# EAGLE design jcbp-290 (EAGLE 8.0.0)
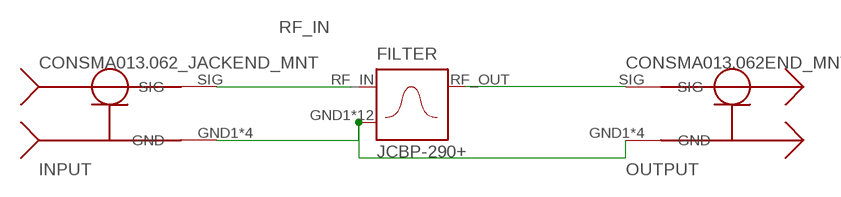
[diagram p0: schematic, sheet 1]

## Parts
FILTER  JCBP-290+  [BG291]
INPUT  CONSMA013.062_JACKEND_MNT  [SMA_EDGE_MNT]
OUTPUT  CONSMA013.062END_MNT  [SMA_EDGE_MNT]

## Nets
GND: FILTER.GND1(GND) FILTER.GND3(GND) FILTER.GND4(GND) FILTER.GND5(GND) FILTER.GND6(GND) FILTER.GND7(GND) FILTER.GND8(GND) FILTER.GND10(GND) FILTER.GND11(GND) FILTER.GND12(GND) FILTER.GND13(GND) FILTER.GND14(GND) INPUT.GND1(GND) INPUT.GND2(GND) INPUT.GND3(GND) INPUT.GND4(GND) OUTPUT.GND1(GND) OUTPUT.GND2(GND) OUTPUT.GND3(GND) OUTPUT.GND4(GND)
N$2: FILTER.RF_OUT OUTPUT.SIG
RF_IN: FILTER.RF_IN INPUT.SIG

## Library data of the parts
FILTER = balun:JCBP-290+
INPUT = balun:CONSMA013.062_JACK
OUTPUT = balun:CONSMA013.062

## Net classes
0 default: clearance 0.205 mm

## Board
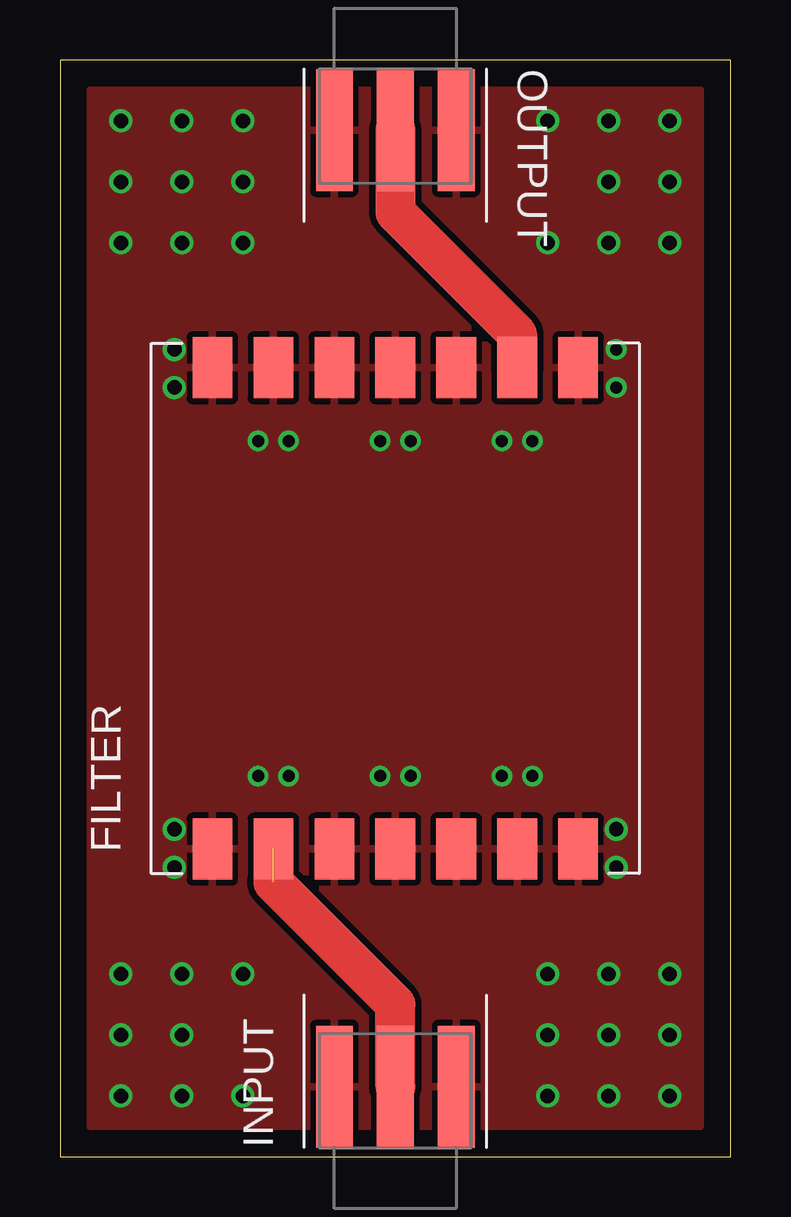
[diagram p1: board, top side]
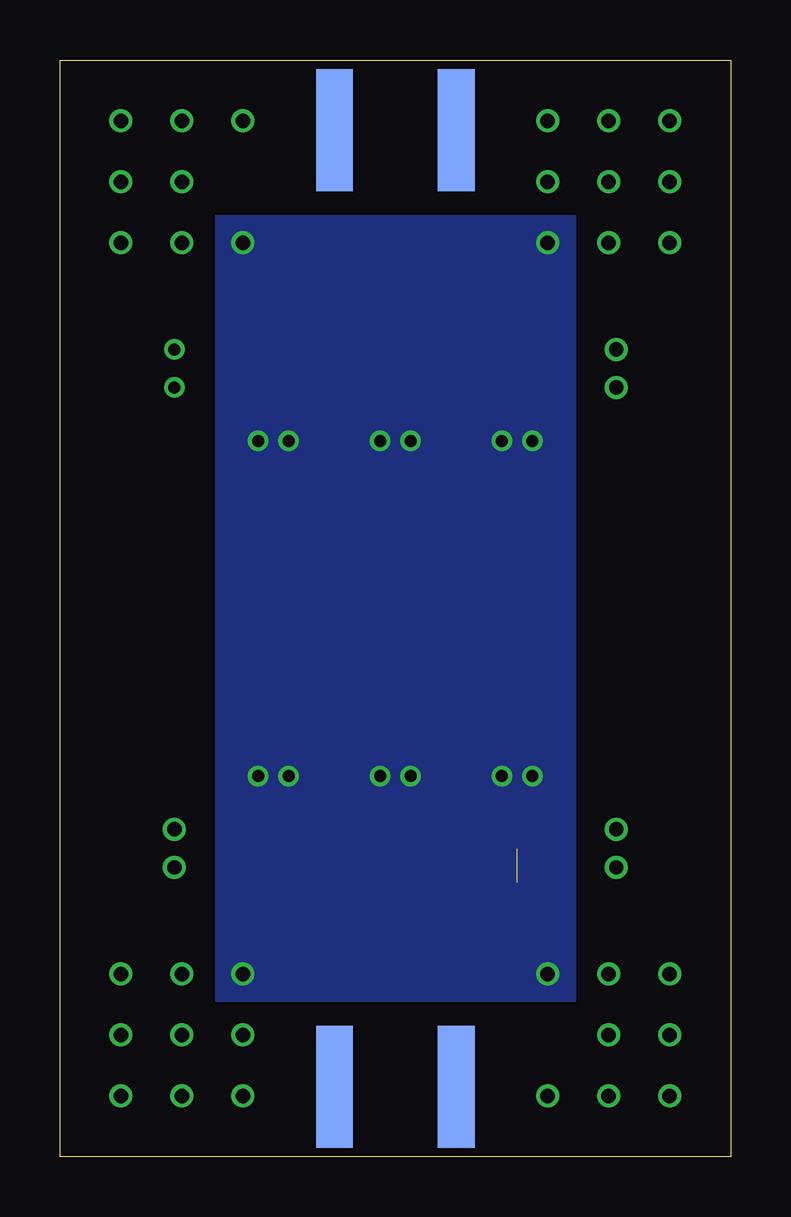
[diagram p2: board, bottom side, seen from below]

Size 27.94 x 45.72 mm. Coordinates in mm from the lower left corner, seen from the top.
Outline: 0,0 27.94,0 27.94,45.72 0,45.72 0,0
Copper layers (1*16): Top 0.0356mm / dielectric 1.5011mm / Bottom 0.0356mm
Design rules "LaenPCBOrder": minimum track width 6mil, minimum drill 13mil, track to track 6mil, track to pad 6mil, pad to pad 6mil, via to via 6mil, smd to smd 6mil, copper to edge 15mil, drill to drill 6mil, minimum pad ring 7mil, minimum via ring 7mil, stop-mask expansion 3mil, vias tented up to drill 0mil, thermal gap 10mil

### Footprints (pad centres in the part's own frame; a part is rotated, then mirrored left to right if it is on the bottom)
BG291 = smd 1.651 x 2.54: GND1 -7.62,-10.033; GND3 -2.54,-10.033; GND4 0,-10.033; GND5 2.54,-10.033; GND6 5.08,-10.033; GND7 7.62,-10.033; GND8 7.62,10.033; GND10 2.54,10.033; GND11 0,10.033; GND12 -2.54,10.033; GND13 -5.08,10.033; GND14 -7.62,10.033; RF_IN -5.08,-10.033; RF_OUT 5.08,10.033
SMA_EDGE_MNT = smd 1.524 x 5.08 bottom: GND1 -2.54,0; GND2 2.54,0 | smd 1.524 x 5.08: GND3 -2.54,0; GND4 2.54,0; SIG 0,0

### Placement (x,y rotation side)
FILTER  13.97,22.86 0 top
INPUT  13.97,2.92 180 top
OUTPUT  13.97,42.8 0 top

### Tracks (layer width: path | path; a pad name or v marks a point on that pad's centre or on a via)
GND  (via drill 0.5, 0.6)
  other vias: 2.54,43.18 2.54,40.64 2.54,38.1 5.08,43.18 5.08,40.64 5.08,38.1 7.62,43.18 7.62,40.64 7.62,38.1 2.54,7.62 2.54,5.08 2.54,2.54 5.08,2.54 5.08,5.08 5.08,7.62 7.62,7.62 7.62,2.54 20.32,7.62 20.32,5.08 20.32,2.54 22.86,2.54 22.86,5.08 22.86,7.62 25.4,7.62 25.4,5.08 25.4,2.54 20.32,38.1 20.32,43.18 22.86,43.18 22.86,40.64 22.86,38.1 25.4,43.18 25.4,40.64 25.4,38.1 8.26,15.88 9.53,15.88 13.34,15.88 14.61,15.88 18.41,15.88 19.68,15.88 8.26,29.84 9.53,29.84 13.34,29.84 14.61,29.84 18.41,29.84 19.68,29.84 4.76,32.07 4.76,33.66 23.18,32.07 23.18,33.66 4.76,12.06 4.76,13.65 23.18,12.06 23.18,13.65
  pour Top (isolate 0.254): 1.27,44.45 26.67,44.45 26.67,1.27 1.27,1.27
  pour Bottom (isolate 6.452): 1.27,1.27 8.89,1.27 19.05,1.27 26.67,1.27 26.67,44.45 19.05,44.45 8.89,44.45 1.27,44.45
  pour Top: 4.45,11.56 4.45,16.51 23.5,16.51 23.5,11.56 10.54,11.56 10.54,15.37 7.24,15.37 7.24,11.56
  pour Top: 23.5,34.16 23.5,29.21 4.45,29.21 4.45,34.16 17.4,34.16 17.4,30.35 20.7,30.35 20.7,34.16
N$2
  Top 1.676: OUTPUT.SIG 13.97,39.37 19.05,34.29 FILTER.RF_OUT
RF_IN  (1 unrouted)
  Top 1.676: INPUT.SIG 13.97,6.35 8.89,11.43